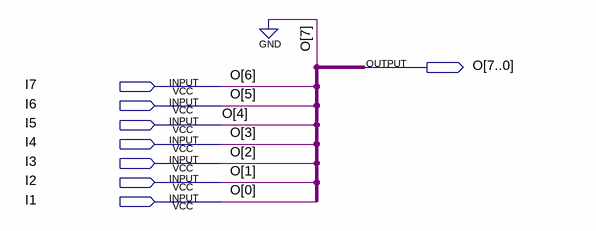
[diagram p0: schematic sheet]
// Quartus schematic SR1.bdf as structural Verilog: 0 symbols, 8 pins
module SR1 (
  input  I7,
  input  I6,
  input  I5,
  input  I4,
  input  I3,
  input  I2,
  input  I1,
  output [7:0] O
);


  assign O = {1'b0, I7, I6, I5, I4, I3, I2, I1};
endmodule
